# Altium schematic sheet MYBOARD_01-Contents.SchDoc
size C
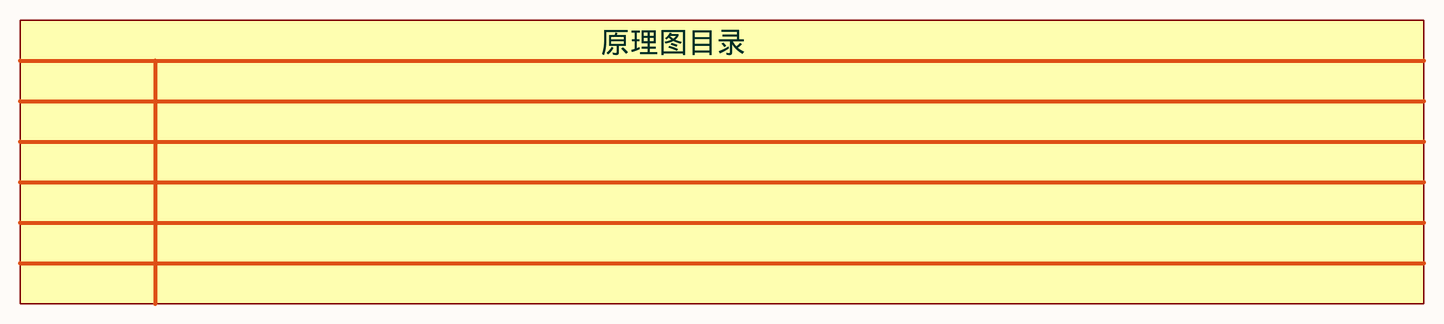
[diagram p0: MYBOARD_01-Contents.SchDoc]

## Notes on the sheet
- 原理图目录